# EAGLE design LITAF_TEMPTRESS (EAGLE 9.6.2)
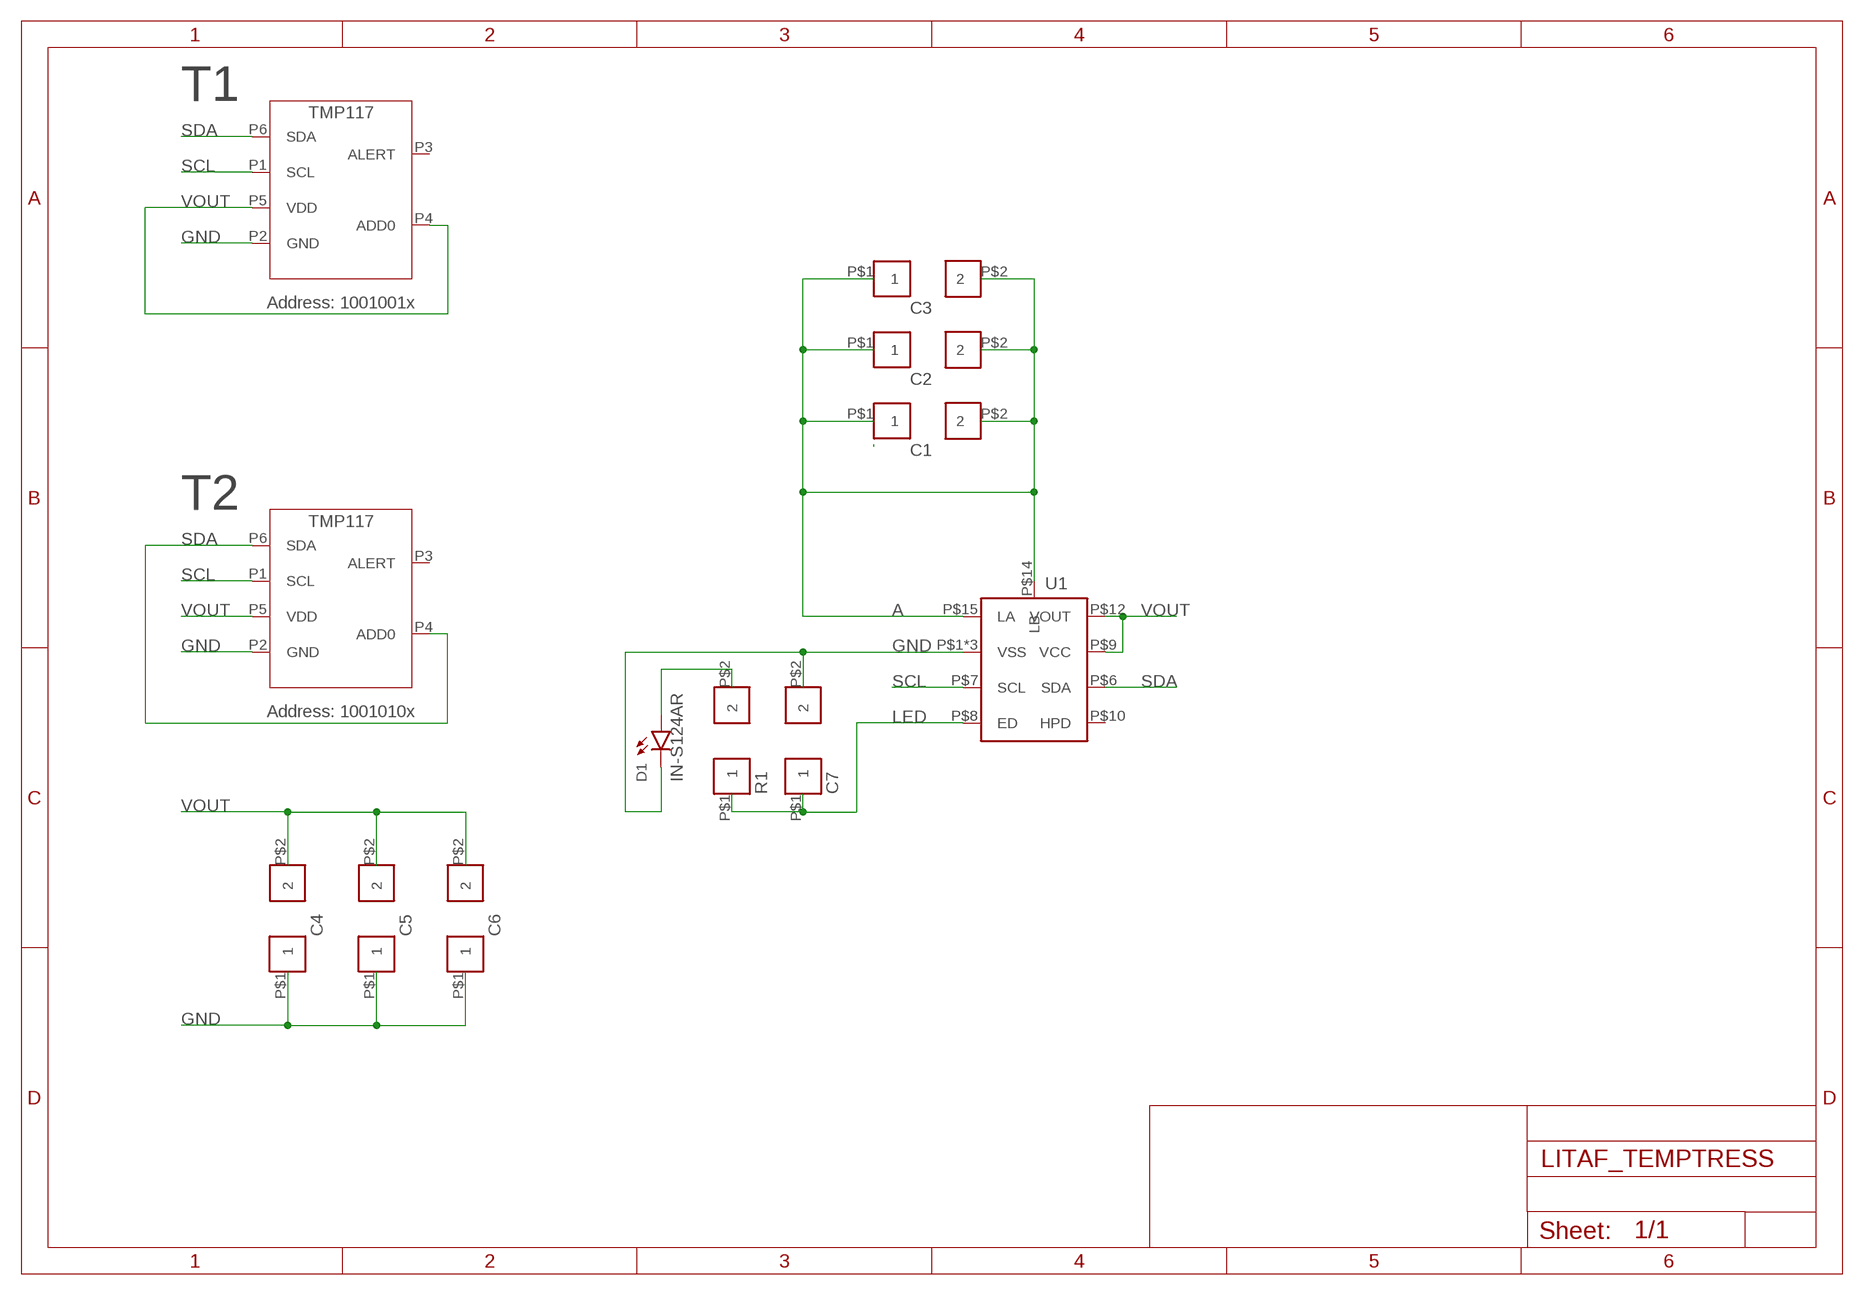
[diagram p0: schematic, sheet 1]

## Parts
C1  0402-CAP  [0402-SMT]
C2  0402-CAP  [0402-SMT]
C3  0402-CAP  [0402-SMT]
C4  0603-CAP  [0603-SMT[WIDE]]
C5  0402-CAP  [0402-SMT]
C6  0402-CAP  [0402-SMT]
C7  0402-CAP  [0402-SMT]
D1  IN-S124AR  [IN-S124AR]
R1  0402-CAP  [0402-SMT]
T1  TMP117  [DRV0006B]
T2  TMP117  [DRV0006B]
U1  NTAG5_LINK_NTP53X2  [SOT1161-2]

## Nets
A: C1.P$1 C1.P$2 C2.P$1 C2.P$2 C3.P$1 C3.P$2 U1.P$14(LB) U1.P$15(LA)
GND: C4.P$1 C5.P$1 C6.P$1 C7.P$2 D1.P$2(C) T1.P2(GND) T2.P2(GND) U1.P$1(VSS) U1.P$2(VSS) U1.P$11(VSS)
LED: C7.P$1 R1.P$1 U1.P$8(ED)
N$1: D1.P$1(A) R1.P$2
SCL: T1.P1(SCL) T2.P1(SCL) U1.P$7(SCL)
SDA: T1.P6(SDA) T2.P4(ADD0) T2.P6(SDA) U1.P$6(SDA)
VOUT: C4.P$2 C5.P$2 C6.P$2 T1.P4(ADD0) T1.P5(VDD) T2.P5(VDD) U1.P$9(VCC) U1.P$12(VOUT)
Unconnected: T1.P3(ALERT) T2.P3(ALERT) U1.P$10(HPD)

## Notes on the sheet
- T1
- Address: 1001001x
- T2
- Address: 1001010x
- D1

## Library data of the parts
C1-C3 C5 C6 = LITAF_TEMPTRESS:0402-CAP
C4 = LITAF_TEMPTRESS:0603-CAP
C7 R1 = LITAF_TEMPTRESS:0402-CAP*?
D1 = LITAF_TEMPTRESS:IN-S124AR
T1 T2 = LITAF_TEMPTRESS:TMP117
U1 = LITAF_TEMPTRESS:NTAG5_LINK_NTP53X2

## Board
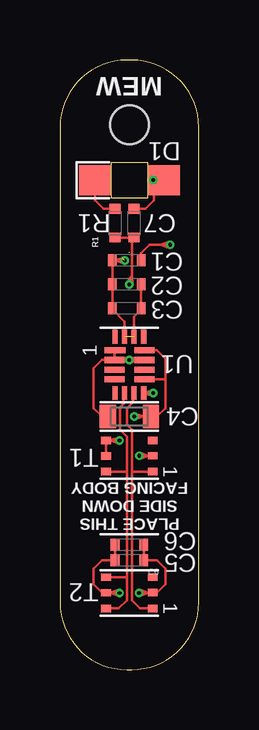
[diagram p1: board, top side]
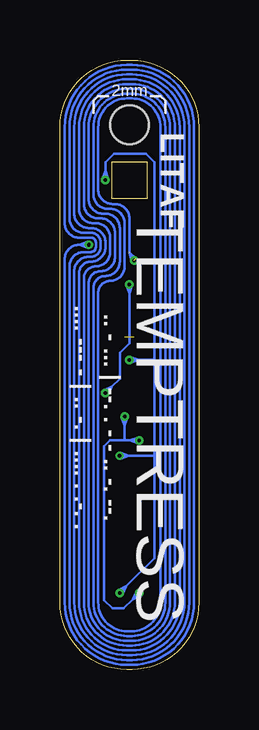
[diagram p2: board, bottom side, seen from below]

Size 5.8 x 25.4 mm. Coordinates in mm from the lower left corner, seen from the top.
Outline: 5.8,2.8 5.8,22.6 arc90 3,25.4 2.8,25.4 arc90 0,22.6 0,2.8 arc90 2.8,0 3,0 arc90 5.8,2.8
Copper layers (1*16): Top 0.035mm / dielectric 0.025mm / Bottom 0.035mm
Design rules "PCBWay_Flex2Layer_2024-04-03": minimum track width 0.06mm, minimum drill 0.15mm, track to track 0.06mm, track to pad 0.06mm, pad to pad 0.06mm, via to via 0.06mm, smd to smd 0mil, copper to edge 0.15mm, drill to drill 0.26mm, minimum pad ring 0.1mm, minimum via ring 0.1mm, stop-mask expansion 0.05mm, vias tented up to drill 0.3mm, thermal gap 0.1mm
Holes 1.6 mm at 2.9,22.7

### Footprints (pad centres in the part's own frame; a part is rotated, then mirrored left to right if it is on the bottom)
0402-SMT = smd 0.4 x 0.5: P$1 -0.6,0; P$2 0.6,0
0603-SMT[WIDE] = smd 0.7 x 1: P$1 -0.9,0; P$2 0.9,0
IN-S124AR = smd 1.35 x 1.25: P$1 -1.43,0; P$2 1.43,0
DRV0006B = smd 0.45 x 0.3: P1 -0.975,0.65; P2 -0.975,-0.01; P3 -0.975,-0.65; P4 0.975,-0.65; P5 0.975,0; P6 0.975,0.65
SOT1161-2 = smd 0.9 x 0.22: P$1 -0.6,0.6 | smd 0.85 x 0.22: P$2 -0.625,0.2; P$3 -0.625,-0.2; P$4 -0.625,-0.6; P$9 0.625,-0.6; P$10 0.625,-0.2; P$11 0.625,0.2; P$12 0.625,0.6 | smd 0.22 x 0.55: P$5 -0.6,-1.175; P$6 -0.2,-1.175; P$7 0.2,-1.175; P$8 0.6,-1.175; P$13 0.6,1.175; P$14 0.2,1.175; P$15 -0.2,1.175; P$16 -0.6,1.175

### Placement (x,y rotation side)
C1  2.79,16.05 180 top
C2  2.79,17.05 0 top
C3  2.79,15.05 180 top
C4  2.9,10.55 0 top
C5  2.9,4.55 180 top
C6  2.9,5.2 180 top
C7  3.1,18.6 90 top
D1  2.9,20.4 0 top
R1  2.3,18.6 90 top
T1  2.9,8.9 180 top
T2  2.9,3.2 180 top
U1  2.9,12.7 0 top

### Tracks (layer width: path | path; a pad name or v marks a point on that pad's centre or on a via)
A  (via drill 0.15)  (3 unrouted)
  Top 0.1: v2.7,17.05 2.33,17.05 | 2.33,17.05 C2.P$1 C1.P$2 C3.P$2 2.19,15.01 2.7,14.5 U1.P$15 | v4.6,17.7 4.22,17.7 | 4.22,17.7 3.74,17.7 3.39,17.35 C2.P$2 | C1.P$1 C3.P$1 3.39,14.99 3.1,14.7 U1.P$14 | 4.22,17.7 4.56,17.58 v4.6,17.7 | 4.22,17.7 4.56,17.82 v4.6,17.7 | 2.33,17.05 2.66,16.93 v2.7,17.05 | 2.33,17.05 2.66,17.17 v2.7,17.05
  Bottom 0.1: v4.6,17.7 4.97,17.7 | 4.97,17.7 5,17.7 arc-90 5.6,17.1 5.6,2.8 arc-90 3,0.2 2.8,0.2 arc-90 0.2,2.8 0.2,22.6 arc-90 2.8,25.2 3,25.2 arc-90 5.6,22.6 5.6,18.6 arc-90 5,18 4.5,18 arc90 4.3,17.8 4.3,17.6 arc90 4.5,17.4 4.8,17.4 arc-90 5.4,16.8 5.4,2.8 arc-90 3,0.4 2.8,0.4 arc-90 0.4,2.8 0.4,22.6 arc-90 2.8,25 3,25 arc-90 5.4,22.6 5.4,18.8 arc-90 4.8,18.2 4.5,18.2 arc90 4.1,17.8 4.1,17.6 arc90 4.5,17.2 4.6,17.2 arc-90 5.2,16.6 5.2,2.8 arc-90 3,0.6 2.8,0.6 arc-90 0.6,2.8 0.6,22.6 arc-90 2.8,24.8 3,24.8 arc-90 5.2,22.6 5.2,19 arc-90 4.6,18.4 4.5,18.4 arc90 3.9,17.8 3.9,17.6 arc90 4.5,17 arc-90 5,16.5 5,2.8 arc-90 3,0.8 2.8,0.8 arc-90 0.8,2.8 0.8,22.6 arc-90 2.8,24.6 3,24.6 arc-90 5,22.6 5,19.2 arc-90 4.4,18.6 4.3,18.6 arc90 3.7,18 3.7,17.4 arc90 4.3,16.8 arc-90 4.8,16.3 4.8,2.8 arc-90 3,1 2.8,1 arc-90 1,2.8 1,22.6 arc-90 2.8,24.4 3,24.4 arc-90 4.8,22.6 4.8,19.4 arc-90 4.2,18.8 4.1,18.8 arc90 3.5,18.2 3.5,17.2 arc90 4.1,16.6 arc-90 4.6,16.1 4.6,2.8 arc-90 3,1.2 2.8,1.2 arc-90 1.2,2.8 1.2,22.6 arc-90 2.8,24.2 3,24.2 arc-90 4.6,22.6 4.6,19.6 arc-90 4,19 3.9,19 arc90 3.3,18.4 3.3,17 arc90 3.9,16.4 arc-90 4.4,15.9 4.4,2.8 arc-90 3,1.4 2.8,1.4 arc-90 1.4,2.8 1.4,22.6 arc-90 2.8,24 3,24 arc-90 4.4,22.6 4.4,19.8 arc-90 3.8,19.2 3.7,19.2 arc90 3.1,18.6 3.1,16.8 arc90 3.7,16.2 arc-90 4.2,15.7 4.2,2.8 arc-90 3,1.6 2.8,1.6 arc-90 1.6,2.8 1.6,22.6 arc-90 2.8,23.8 3,23.8 arc-90 4.2,22.6 4.2,20 arc-90 3.6,19.4 3.5,19.4 arc90 2.9,18.8 2.9,17.37 v2.7,17.05 | v4.6,17.7 4.72,17.74 | v4.6,17.7 4.72,17.66 | 4.97,17.7 4.64,17.82 v4.6,17.7
  Bottom 0.1: 4.97,17.7 4.64,17.58 v4.6,17.7 | 2.9,17.38 2.62,17.14 | 2.9,17.37 2.82,17.01
GND  (via drill 0.15)
  Top 0.1: U1.P$11 3.27,12.9 | 3.27,12.9 v2.9,12.9 | U1.P$2 2.27,13.3 U1.P$1 | v3.9,20.4 4.12,20.4 | v3.3,3.2 v3.3,3.21 3.67,3.21 | 3.67,3.21 T2.P2 4.05,3.21 4.4,3.56 4.4,4.2 4.05,4.55 C5.P$1 C6.P$1 | 4.12,20.4 3.94,20.49 v3.9,20.4 | 4.12,20.4 3.94,20.31 v3.9,20.4 | v3.31,8.91 3.69,8.91 | 3.69,8.91 T1.P2 | C4.P$1 1.75,10.55 1.4,10.9 1.4,12.55 1.75,12.9 U1.P$2 | 4.28,20.4 D1.P$2 3.93,20 3.93,19.55 3.58,19.2 C7.P$2 | 4.28,20.4 v3.9,20.4 | v2.9,12.9 2.52,12.9 | 2.52,12.9 U1.P$2 | 3.27,12.9 2.94,13.02 v2.9,12.9 | 3.27,12.9 2.94,12.78 v2.9,12.9 | 2.52,12.9 2.86,12.78 v2.9,12.9 | 2.52,12.9 2.86,13.02 v2.9,12.9 | 4.28,20.4 3.94,20.52 v3.9,20.4 | 4.28,20.4 3.94,20.28 v3.9,20.4 | 3.69,8.91 3.35,9.03 v3.31,8.91 | 3.69,8.91 3.35,8.79 v3.31,8.91 | 3.67,3.21 3.34,3.32 v3.3,3.2 | 3.67,3.21 3.35,3.08 v3.3,3.2
  Bottom 0.1: v2.9,12.9 2.52,12.9 | 2.52,12.9 1.85,12.9 | 1.85,12.9 1.85,21.15 2.2,21.5 3.55,21.5 3.9,21.15 3.9,20.77 | 3.9,20.77 v3.9,20.4 | v3.31,8.91 2.94,8.91 | 2.94,8.91 1.85,8.91 | 1.85,8.91 1.85,12.9 | 1.85,8.91 1.85,4.65 3.04,3.46 | 3.04,3.46 v3.3,3.2 | 2.52,12.9 2.86,12.78 v2.9,12.9 | 2.52,12.9 2.86,13.02 v2.9,12.9 | 3.9,20.77 3.78,20.44 v3.9,20.4 | 3.9,20.77 4.02,20.44 v3.9,20.4 | 2.94,8.91 3.27,8.79 v3.31,8.91 | 2.94,8.91 3.27,9.03 v3.31,8.91 | 3.04,3.46 3.19,3.15 v3.3,3.2 | 3.04,3.46 3.35,3.31 v3.3,3.2
LED  (via drill 0.15)
  Top 0.1: 3,16.41 3,16.3 v2.9,16.05 | U1.P$8 3.52,11.53 | 3.52,11.53 v3.9,11.53 | 3,16.41 2.8,16.12 v2.9,16.05 | 3,16.41 3.02,16.06 v2.9,16.05 | 3.52,11.53 3.86,11.41 v3.9,11.53 | 3.52,11.53 3.86,11.64 v3.9,11.53 | 3,16.41 3,18 C7.P$1 R1.P$1
  Bottom 0.1: v2.9,16.05 2.9,15.68 | 2.9,15.68 2.9,13.6 3.3,13.2 3.3,12.12 3.63,11.79 | v3.9,11.53 3.63,11.79 | 2.9,15.68 3.02,16.01 v2.9,16.05 | 2.9,15.68 2.78,16.01 v2.9,16.05 | 3.63,11.79 3.79,11.47 v3.9,11.53 | 3.63,11.79 3.95,11.64 v3.9,11.53
N$1
  Top 0.1: 1.5,20.4 D1.P$1 1.47,19.55 1.82,19.2 R1.P$2
SCL
  Top 0.1: U1.P$7 3.05,11.47 3.05,11.15 2.8,10.9 2.8,10.2 3,10 3,8.25 | T1.P1 3,8.25 | 3,8.25 3,2.9 3.35,2.55 T2.P1
SDA
  Top 0.1: T1.P6 2.8,8.25 | T2.P6 2.45,2.55 2.8,2.9 2.8,3.85 | 2.8,3.85 2.8,8.25 | T2.P4 2.8,3.85 | U1.P$6 2.65,11.47 2.65,11.1 2.5,10.9 2.5,10 2.8,9.7 2.8,8.25
VOUT  (via drill 0.15)
  Top 0.1: T1.P5 T1.P4 2.12,9.55 | v2.49,3.2 2.12,3.2 | 2.12,3.2 T2.P5 1.75,3.2 1.4,3.55 1.4,4.2 1.75,4.55 C5.P$2 C6.P$2 | 2.12,9.55 v2.49,9.55 | 4.4,12.1 4.4,10.9 4.05,10.55 C4.P$2 3.48,10.55 | 4.4,12.1 4.4,12.95 4.05,13.3 U1.P$12 | U1.P$9 4.4,12.1 | 3.48,10.55 v3.1,10.55 | 2.12,9.55 2.45,9.43 v2.49,9.55 | 2.12,9.55 2.45,9.67 v2.49,9.55 | 2.12,3.2 2.45,3.08 v2.49,3.2 | 2.12,3.2 2.45,3.32 v2.49,3.2 | 3.48,10.55 3.14,10.67 v3.1,10.55 | 3.48,10.55 3.14,10.43 v3.1,10.55
  Bottom 0.1: 3.1,9.55 3.7,9.55 3.95,9.3 3.95,2.9 3.6,2.55 3.14,2.55 2.75,2.94 | 3.1,9.55 2.87,9.55 | 2.87,9.55 v2.49,9.55 | v3.1,10.55 3.1,10.18 | 3.1,10.18 3.1,9.55 | v2.49,3.2 2.75,2.94 | 2.87,9.55 2.53,9.67 v2.49,9.55 | 2.87,9.55 2.53,9.43 v2.49,9.55 | 2.75,2.94 2.6,3.25 v2.49,3.2 | 2.75,2.94 2.44,3.09 v2.49,3.2 | 3.1,10.18 3.22,10.51 v3.1,10.55 | 3.1,10.18 2.98,10.51 v3.1,10.55

### Text on the board
tPlace: MEW | D1 | R1 | C7 | C1 | C2 | C3 | 1 | U1 | C4 | T1 | PLACE THIS / SIDE DOWN / FACING BODY | 1 | C6 | T2 | C5 | 1
bPlace: 2mm
bNames: LITAF | TEMPTRESS | .. - ... | --. . - - .. -. --. / .... --- - | .. -. | .... . .-. .